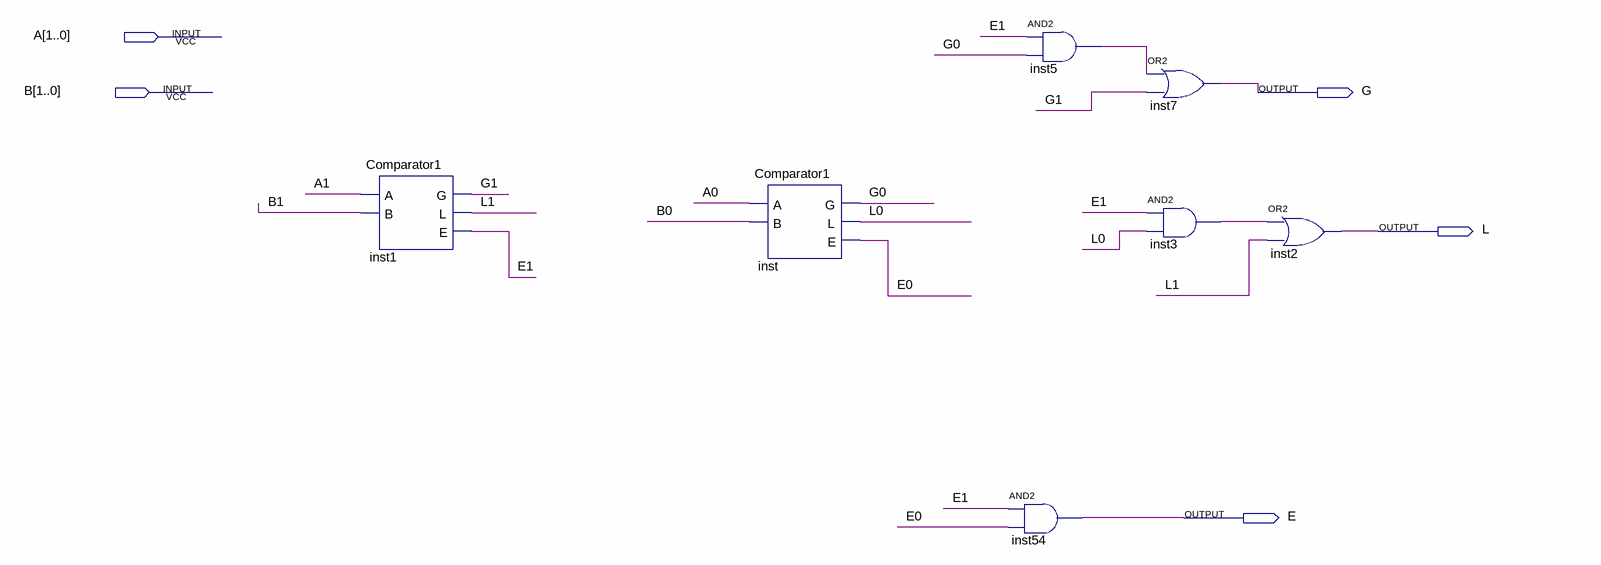
[diagram p0: schematic sheet]
// Quartus schematic Comparator2.bdf as structural Verilog: 7 symbols, 5 pins
module Comparator2 (
  input  [1:0] A,
  input  [1:0] B,
  output G,
  output L,
  output E
);

  wire E0, E1, G0, G1, inst3_out, inst5_out, L0, L1;

  Comparator1 inst1 (.A(A[1]), .B(B[1]), .G(G1), .L(L1), .E(E1));
  Comparator1 inst (.A(A[0]), .B(B[0]), .G(G0), .L(L0), .E(E0));
  and inst54 (E, E1, E0);
  and inst5 (inst5_out, E1, G0);
  or inst7 (G, inst5_out, G1);
  and inst3 (inst3_out, E1, L0);
  or inst2 (L, inst3_out, L1);
endmodule
